# Altium project HDMI8x8.PrjPcb
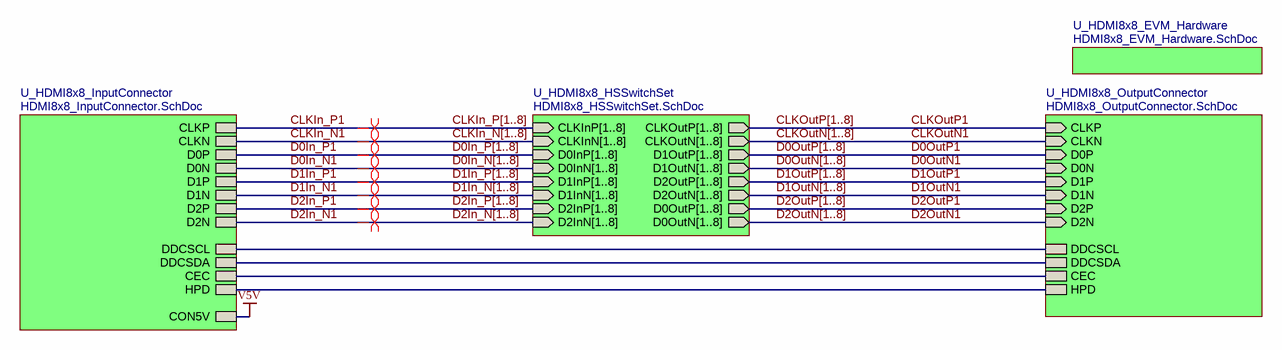
[diagram p0: HDMI8x8_CoverSheet.SchDoc]
TID: N/A; TechSupport: http://www.ti.com/support; SCH_Rev: E1; PRJ_Title: Change in menu Project|Project Options|Parameters; PRJ_Number: XX####; PRJ_Engineer: Enter name of project lead; PRJ_Customer: Public Release; PCB_Rev: E1; PCB_Layout: Who did the Layout?; CopyrightYear: 2016
5 sheets, 38 parts. Net scope: hierarchical (ports join the sheet entries above them; power ports are global).
Board file: HDMI8x8_EVM.PcbDoc
Sheets:
  HDMI8x8_CoverSheet.SchDoc
    U_HDMI8x8_InputConnector = HDMI8x8_InputConnector.SchDoc
    U_HDMI8x8_EVM_Hardware = HDMI8x8_EVM_Hardware.SchDoc
    U_HDMI8x8_HSSwitchSet = HDMI8x8_HSSwitchSet.SchDoc
    U_HDMI8x8_OutputConnector = HDMI8x8_OutputConnector.SchDoc

## Sheet HDMI8x8_CoverSheet.SchDoc
size A4; Date: Not shown in title block; ApprovedBy: Not shown in title block; CheckedBy: Not shown in title block; Author: Not shown in title block; CompanyName: Not shown in title block; Engineer: Not shown in title block; Organization: Not shown in title block; Address1: Not shown in title block; Address2: Not shown in title block; Address3: Not shown in title block; Address4: Not shown in title block; DocumentNumber: 1; Revision: Use project parameter SCH_Rev; SheetNumber: 1; SheetTotal: 3; PageSetup: Record=PageOptions|CenterHorizontal=True|CenterVertical=True|PrintScale=1.00|XCorrection=1.00|YCorrection=1.00|PrintKind=0|BorderSize=5000000|LeftOffset=0|BottomOffset=0|Orientation=2|PaperLength=1000|PaperWidth=1000|Scale=100|PaperSource=15|PrintQuality=600|MediaType=1|DitherType=10|PaperKind=Letter|PrintScaleMode=1; CurrentTime: Not shown in title block; CurrentDate: Not shown in title block; Time: Not shown in title block; DocumentFullPathAndName: Not shown in title block; DocumentName: Not shown in title block; ModifiedDate: Not shown in title block; ImagePath: Not shown in title block

### Sub-sheets
U_HDMI8x8_EVM_Hardware = HDMI8x8_EVM_Hardware.SchDoc: no entries
U_HDMI8x8_HSSwitchSet = HDMI8x8_HSSwitchSet.SchDoc: CLKInP[1..8] (in), CLKInN[1..8] (in), CLKOutP[1..8] (out), CLKOutN[1..8] (out), D1InP[1..8] (in), D1InN[1..8] (in), D1OutP[1..8] (out), D1OutN[1..8] (out), D2InP[1..8] (in), D2InN[1..8] (in), D2OutP[1..8] (out), D2OutN[1..8] (out), D0InP[1..8] (in), D0InN[1..8] (in), D0OutP[1..8] (out), D0OutN[1..8] (out)
U_HDMI8x8_InputConnector = HDMI8x8_InputConnector.SchDoc: D2P, D2N, D1P, D1N, D0P, D0N, CLKP, CLKN, CEC, DDCSCL, DDCSDA, CON5V, HPD
U_HDMI8x8_OutputConnector = HDMI8x8_OutputConnector.SchDoc: D2P (in), D2N (in), D1P (in), D1N (in), D0P (in), D0N (in), CLKP (in), CLKN (in), CEC, DDCSCL, DDCSDA, HPD

### Nets
CEC: sheet U_HDMI8x8_InputConnector/CEC, sheet U_HDMI8x8_OutputConnector/CEC
DDCSCL: sheet U_HDMI8x8_InputConnector/DDCSCL, sheet U_HDMI8x8_OutputConnector/DDCSCL
DDCSDA: sheet U_HDMI8x8_InputConnector/DDCSDA, sheet U_HDMI8x8_OutputConnector/DDCSDA
HPD: sheet U_HDMI8x8_InputConnector/HPD, sheet U_HDMI8x8_OutputConnector/HPD

### Buses and harness runs
bus CLKIn_N[1..8] = sheet U_HDMI8x8_HSSwitchSet/CLKInN[1..8]
bus CLKIn_P[1..8] = sheet U_HDMI8x8_HSSwitchSet/CLKInP[1..8]
bus CLKOutN[1..8] = sheet U_HDMI8x8_HSSwitchSet/CLKOutN[1..8]
bus CLKOutP[1..8] = sheet U_HDMI8x8_HSSwitchSet/CLKOutP[1..8]
bus D0In_N[1..8] = sheet U_HDMI8x8_HSSwitchSet/D0InN[1..8]
bus D0In_P[1..8] = sheet U_HDMI8x8_HSSwitchSet/D0InP[1..8]
bus D0OutN[1..8] = sheet U_HDMI8x8_HSSwitchSet/D1OutN[1..8]
bus D0OutP[1..8] = sheet U_HDMI8x8_HSSwitchSet/D1OutP[1..8]
bus D1In_N[1..8] = sheet U_HDMI8x8_HSSwitchSet/D1InN[1..8]
bus D1In_P[1..8] = sheet U_HDMI8x8_HSSwitchSet/D1InP[1..8]
bus D1OutN[1..8] = sheet U_HDMI8x8_HSSwitchSet/D2OutN[1..8]
bus D1OutP[1..8] = sheet U_HDMI8x8_HSSwitchSet/D2OutP[1..8]
bus D2In_N[1..8] = sheet U_HDMI8x8_HSSwitchSet/D2InN[1..8]
bus D2In_P[1..8] = sheet U_HDMI8x8_HSSwitchSet/D2InP[1..8]
bus D2OutN[1..8] = sheet U_HDMI8x8_HSSwitchSet/D0OutN[1..8]
bus D2OutP[1..8] = sheet U_HDMI8x8_HSSwitchSet/D0OutP[1..8]

### Layout directives
differential pair: CLKIn_N1, CLKIn_P1, D0In_N1, D0In_P1, D1In_N1, D1In_P1, D2In_N1, D2In_P1

### Notes on the sheet
- Drawn By:
- SVN Rev:
- Number:
- TID #:
- Orderable:
- Rev:
- Sheet Title:
- File:
- Project Title:
- Designed for:
- Assembly Variant:
- Mod. Date:
- Sheet:
- Size:
- of
- A4
- http://www.ti.com
- Texas Instruments and/or its licensors do not warrant the accuracy or completeness of this specification or any information contained therein. Texas Instruments and/or its licensors do not warrant that this design will meet the specifications, will be suitable for your application or fit for any particular purpose, or will operate in an implementation. Texas Instruments and/or its licensors do not warrant that the design is production worthy. You should completely validate and test your design implementation to confirm the system functionality for your application.
- Engineer:
- Contact:
- © Texas Instruments

## Sheet HDMI8x8_InputConnector.SchDoc
size Letter; Date: Not shown in title block; ApprovedBy: Not shown in title block; CheckedBy: Not shown in title block; Author: Not shown in title block; CompanyName: Not shown in title block; Engineer: Not shown in title block; Organization: Not shown in title block; Address1: Not shown in title block; Address2: Not shown in title block; Address3: Not shown in title block; Address4: Not shown in title block; DocumentNumber: 1; Revision: Use project parameter SCH_Rev; SheetNumber: 2; SheetTotal: 3; PageSetup: Record=PageOptions|CenterHorizontal=True|CenterVertical=True|PrintScale=1.00|XCorrection=1.00|YCorrection=1.00|PrintKind=0|BorderSize=5000000|LeftOffset=0|BottomOffset=0|Orientation=2|PaperLength=1000|PaperWidth=1000|Scale=100|PaperSource=15|PrintQuality=600|MediaType=1|DitherType=10|PaperKind=Letter|PrintScaleMode=1; CurrentTime: Not shown in title block; CurrentDate: Not shown in title block; Time: Not shown in title block; DocumentFullPathAndName: Not shown in title block; DocumentName: Not shown in title block; ModifiedDate: Not shown in title block; ImagePath: Not shown in title block
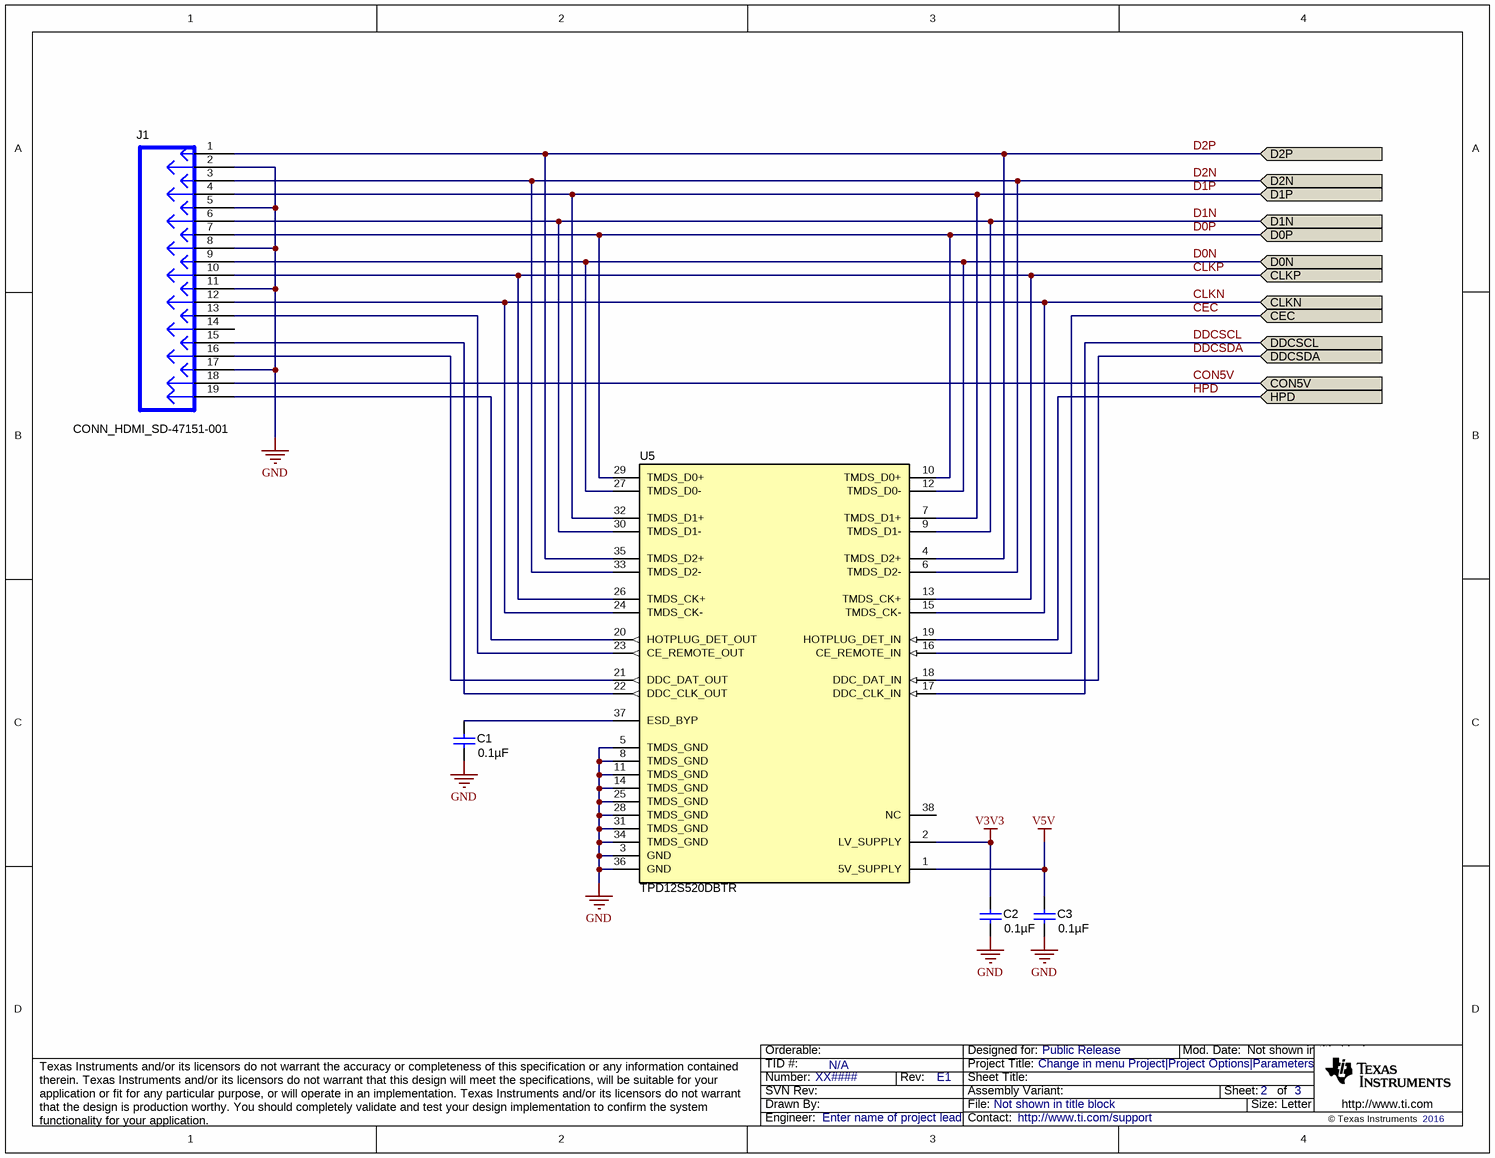
[diagram p1: HDMI8x8_InputConnector.SchDoc]

### Parts
C1  ValueDisplayed: 0.1µF  [0603]  (hidden comment: C0603C104M4RACTU)
C2  ValueDisplayed: 0.1µF  [0603]  (hidden comment: C0603C104M4RACTU)
C3  ValueDisplayed: 0.1µF  [0603]  (hidden comment: C0603C104M4RACTU)
J1  CONN_HDMI_SD-47151-001  [CONN_HDMI_SD-47151]
U5  TPD12S520DBTR  [DBT0038A_N]

### Ports
CEC, CLKN, CLKP, CON5V, D0N, D0P, D1N, D1P, D2N, D2P, DDCSCL, DDCSDA, HPD

### Nets
GND: C1.2 C2.2 C3.2 J1.2 J1.5 J1.8 J1.11 J1.17 U5.3(GND) U5.5(TMDS_GND) U5.8(TMDS_GND) U5.11(TMDS_GND) U5.14(TMDS_GND) U5.25(TMDS_GND) U5.28(TMDS_GND) U5.31(TMDS_GND) U5.34(TMDS_GND) U5.36(GND)
V3V3: C2.1 U5.2(LV_SUPPLY)
V5V: C3.1 J1.18 U5.1(5V_SUPPLY) ; port CON5V  [also labelled CON5V]
CEC: U5.16(CE_REMOTE_IN) ; port CEC
CLKN: J1.12 U5.15(TMDS_CK-) U5.24(TMDS_CK-) ; port CLKN  [project net CLKIn_N1]
CLKP: J1.10 U5.13(TMDS_CK+) U5.26(TMDS_CK+) ; port CLKP  [project net CLKIn_P1]
D0N: J1.9 U5.12(TMDS_D0-) U5.27(TMDS_D0-) ; port D0N  [project net D0In_N1]
D0P: J1.7 U5.10(TMDS_D0+) U5.29(TMDS_D0+) ; port D0P  [project net D0In_P1]
D1N: J1.6 U5.9(TMDS_D1-) U5.30(TMDS_D1-) ; port D1N  [project net D1In_N1]
D1P: J1.4 U5.7(TMDS_D1+) U5.32(TMDS_D1+) ; port D1P  [project net D1In_P1]
D2N: J1.3 U5.6(TMDS_D2-) U5.33(TMDS_D2-) ; port D2N  [project net D2In_N1]
D2P: J1.1 U5.4(TMDS_D2+) U5.35(TMDS_D2+) ; port D2P  [project net D2In_P1]
DDCSCL: U5.17(DDC_CLK_IN) ; port DDCSCL
DDCSDA: U5.18(DDC_DAT_IN) ; port DDCSDA
HPD: U5.19(HOTPLUG_DET_IN) ; port HPD
NetC1_1: C1.1 U5.37(ESD_BYP)
NetJ1_13: J1.13 U5.23(CE_REMOTE_OUT)
NetJ1_15: J1.15 U5.22(DDC_CLK_OUT)
NetJ1_16: J1.16 U5.21(DDC_DAT_OUT)
NetJ1_19: J1.19 U5.20(HOTPLUG_DET_OUT)

Not connected (* = marked no-connect by the designer): J1 14; U5 38(NC)

### Notes on the sheet
- Drawn By:
- SVN Rev:
- Number:
- TID #:
- Orderable:
- Rev:
- Sheet Title:
- File:
- Project Title:
- Designed for:
- Assembly Variant:
- Mod. Date:
- Sheet:
- Size:
- of
- Letter
- http://www.ti.com
- Texas Instruments and/or its licensors do not warrant the accuracy or completeness of this specification or any information contained therein. Texas Instruments and/or its licensors do not warrant that this design will meet the specifications, will be suitable for your application or fit for any particular purpose, or will operate in an implementation. Texas Instruments and/or its licensors do not warrant that the design is production worthy. You should completely validate and test your design implementation to confirm the system functionality for your application.
- Engineer:
- Contact:
- © Texas Instruments

### Library data of the parts
C1-C3 = C0603C104M4RACTU: CAP, CERM, 0.1 µF, 16 V, +/- 20%, X7R, 0603; Manufacturer: Kemet; Polarized: N; CompType: Capacitor; Value: 0.1uF; U/M: EA; Cap_F: 0.0000001; Tolerance_%: 20; Value1: Unknown; VDC_V: 16; Value2: 16V; TaMin_C: -55; TaMax_C: 125; AEC Category: Q200; SymbolVersion: 2008-07-09; PartNumber: C0603C104M4RACTU; PackageReference: 0603; RoHS: Y; MountType: SMT; Technology: Ceramic; TempCo: X7R; Cap_Case: 0603; Published: 2008-06-19; Publisher: Texas Instruments; LatestRevisionDate: 2016-01-22; ComponentLink1Description: Datasheet link; ComponentLink1URL: http://www.kemet.com/kemet/web/homepage/kechome.nsf/vapubfiles/F3102_Y5V.pdf/$file/F3102_Y5V.pdf; Supplier 1: Digi-Key; Supplier Part Number 1: 399-1099-1-ND; Supplier 2: Mouser; Supplier Part Number 2: 80-C0603C104M4R; Supplier 3: Farnell; Supplier Part Number 3: 1166968; AEC Qualified: ?
J1 = CONN_HDMI_SD-47151-001: Connector, HDMI, RA, 19 pin; Manufacturer: Molex; PartNumber: SD-47151-0001; area: 255.00 mm; Value: SD-47151-0001; ComponentHeight: 4.5 mm; SymbolVersion: 10/16/2009 11:19:45; ComponentLink1URL: \\vette02\pmp_pcb\pcad_pdf's\471510001_sd.pdf; PackageReference: 12.50 x 15.00 mm; ComponentLink1Description: AEO Datasheet Link
U5 = TPD12S520DBTR: HDMI Receiver Port Protection and Interface Device, 12 Channels, -40 to +85 degC, 38-pin TSSOP (DBT), Green (RoHS & no Sb/Br); Manufacturer: Texas Instruments; Alternate PartNumber: Equivalent; Breakdown Voltage(Min)(V): 9; Differential Capacitance(pF): 0.05; IEC 61000-4-2 Contact(+/- kV): 8; IO Capacitance(Typ)(pF): 0.9; SubFamily: ESD Solution; DatasheetVersion: SLVS640C; PackageVersion: revI, Mar-2011; PackageReference: DBT0038A; PackageDescription: 38-Pin Plastic Small Outline 0.5 mm Pitch; Supplier 1: Digi-Key; Supplier Part Number 1: 296-23617-2-ND; Supplier 2: Digi-Key; Supplier Part Number 2: 296-23617-1-ND; Supplier 3: Digi-Key; Supplier Part Number 3: 296-23617-6-ND; Supplier 4: Newark; Supplier Part Number 4: 85M0176; Supplier 5: Mouser; Supplier Part Number 5: 595-TPD12S520DBTR; Eco-Plan: Green (RoHS & no Sb/Br); IO Leakage Current(nA): 0.05; MountType: SMT; Code_JEDEC: MO-153; PartNumber: TPD12S520DBTR; ComponentLink1Description: Datasheet; ComponentLink1URL: http://www.ti.com/general/docs/lit/getliterature.tsp?genericPartNumber=TPD12S520&fileType=pdf; ComponentLink2Description: URL Link1; ComponentLink2URL: SamplesURL:http://www.ti.com/product/tpd12s520#samples; Alternate Manufacturer: Texas Instruments

## Sheet HDMI8x8_EVM_Hardware.SchDoc
size 431 x 279 mm; Date: Not shown in title block; ApprovedBy: Not shown in title block; CheckedBy: Not shown in title block; Author: Not shown in title block; CompanyName: Not shown in title block; Engineer: Not shown in title block; Organization: Not shown in title block; Address1: Not shown in title block; Address2: Not shown in title block; Address3: Not shown in title block; Address4: Not shown in title block; DocumentNumber: 1; Revision: Use project parameter SCH_Rev; SheetNumber: 3; SheetTotal: 3; PageSetup: Record=PageOptions|CenterHorizontal=True|CenterVertical=True|PrintScale=1.00|XCorrection=1.00|YCorrection=1.00|PrintKind=0|BorderSize=5000000|LeftOffset=0|BottomOffset=0|Orientation=2|PaperLength=1000|PaperWidth=1000|Scale=100|PaperSource=15|PrintQuality=600|MediaType=1|DitherType=10|PaperKind=Letter|PrintScaleMode=1; CurrentTime: Not shown in title block; CurrentDate: Not shown in title block; Time: Not shown in title block; DocumentFullPathAndName: Not shown in title block; DocumentName: Not shown in title block; ModifiedDate: Not shown in title block; ImagePath: Not shown in title block
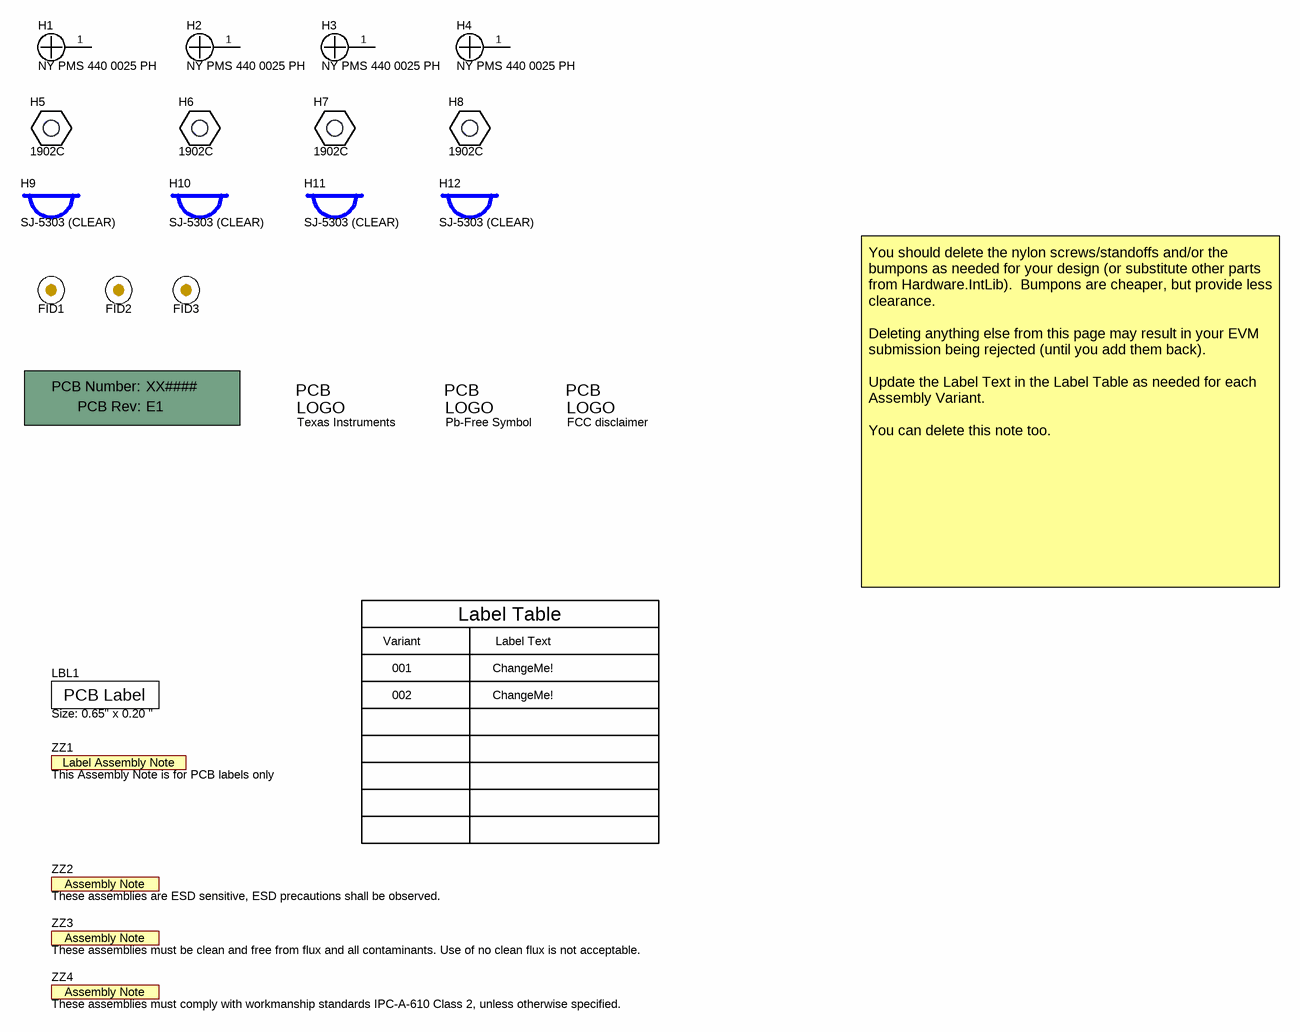
[diagram p2: HDMI8x8_EVM_Hardware.SchDoc]

### Parts
!PCB  Printed Circuit Board  (value not drawn)  (mechanical)
FID1  Fiducial  [Fiducial10-20]  (value not drawn)
FID2  Fiducial  [Fiducial10-20]  (value not drawn)
FID3  Fiducial  [Fiducial10-20]  (value not drawn)
H1  NY PMS 440 0025 PH  [NY PMS 440 0025 PH]
H2  NY PMS 440 0025 PH  [NY PMS 440 0025 PH]
H3  NY PMS 440 0025 PH  [NY PMS 440 0025 PH]
H4  NY PMS 440 0025 PH  [NY PMS 440 0025 PH]
H5  1902C  [Keystone_1902C]
H6  1902C  [Keystone_1902C]
H7  1902C  [Keystone_1902C]
H8  1902C  [Keystone_1902C]
H9  SJ-5303 (CLEAR)  [Bumpon_SJ5003Transparent]
H10  SJ-5303 (CLEAR)  [Bumpon_SJ5003Transparent]
H11  SJ-5303 (CLEAR)  [Bumpon_SJ5003Transparent]
H12  SJ-5303 (CLEAR)  [Bumpon_SJ5003Transparent]
LBL1  Size: 0.65" x 0.20 "  [Label_650x200]
Logo1  Texas Instruments  [TI_Stacked_Overlay_Small]  (no BOM)
Logo2  Pb-Free Symbol  [Pb-Free_Overlay_Small]  (no BOM)
Logo3  FCC disclaimer  [FCC_disclaimer]  (no BOM)
ZZ1  This Assembly Note is for PCB labels only  [AssemblyNoteLabel]  (no BOM)
ZZ2  These assemblies are ESD sensitive, ESD precautions shall be observed.  [AssemblyNote]  (no BOM)
ZZ3  These assemblies must be clean and free from flux and all contaminants. Use of no clean flux is not acceptable.  [AssemblyNote]  (no BOM)
ZZ4  These assemblies must comply with workmanship standards IPC-A-610 Class 2, unless otherwise specified.  [AssemblyNote]  (no BOM)

### Nets

Not connected (* = marked no-connect by the designer): H1 1; H2 1; H3 1; H4 1

### Notes on the sheet
- Variant
- Label Table
- Label Text
- You should delete the nylon screws/standoffs and/or the bumpons as needed for your design (or substitute other parts from Hardware.IntLib).  Bumpons are cheaper, but provide less clearance.
  Deleting anything else from this page may result in your EVM submission being rejected (until you add them back).
  Update the Label Text in the Label Table as needed for each Assembly Variant.
  You can delete this note too.
- 001
- 002
- ChangeMe!
- Drawn By:
- SVN Rev:
- Number:
- TID #:
- Orderable:
- Rev:
- Sheet Title:
- File:
- Project Title:
- Designed for:
- Assembly Variant:
- Mod. Date:
- Sheet:
- Size:
- of
- B
- http://www.ti.com
- Texas Instruments and/or its licensors do not warrant the accuracy or completeness of this specification or any information contained therein. Texas Instruments and/or its licensors do not warrant that this design will meet the specifications, will be suitable for your application or fit for any particular purpose, or will operate in an implementation. Texas Instruments and/or its licensors do not warrant that the design is production worthy. You should completely validate and test your design implementation to confirm the system functionality for your application.
- Engineer:
- Contact:
- © Texas Instruments
- (in symbol AssemblyNote) Assembly Note
- (in symbol AssemblyNoteLabel) Label Assembly Note
- (in symbol FCC_disclaimer) PCB; LOGO
- (in symbol Pb-Free) PCB; LOGO
- (in symbol PCB) PCB Number:; PCB Rev:
- (in symbol THT-14-423-10) PCB Label
- (in symbol TI_Logo) PCB; LOGO

### Library data of the parts
!PCB = PCB: Manufacturer: Any; PartNumber: XX####; SymbolCreator: a0412235; SymbolVersion: 2012-05-30; CompType: PCB; RoHS: O; MountType: N/A; Publisher: Texas Instruments; LatestRevisionDate: 2012-06-27; LatestRevisionNote: Initial Version; Alternate Manufacturer: -; Alternate PartNumber: -
FID1-FID3 = Fiducial: Fiducial mark.  There is nothing to buy or mount.; SymbolCreator: codlsc; SymbolVersion: 2009-11-4; CompType: Fiducial; Publisher: Texas Instruments; LatestRevisionDate: 2014-08-01; LatestRevisionNote: Added Alternate PartNumber and Alternate Manufacturer parameters to appropriate components.; Manufacturer: N/A; MountType: N/A; PackageReference: Fiducial; PartNumber: N/A; ClassName: FiducialMark
H1-H4 = NY PMS 440 0025 PH: Machine Screw, Round, #4-40 x 1/4, Nylon, Philips panhead; Manufacturer: B&F Fastener Supply; CompType: Hardware; SymbolCreator: codlsc; U/M: EA; SymbolVersion: 2009-10-28; MountType: N/A; RoHS: Y; PartNumber: NY PMS 440 0025 PH; PackageReference: Screw; DigiKeyPartNumber: H542-ND; ComponentLink1Description: Datasheet Link; ComponentLink1URL: http://www.fasnetdirect.com/refguide/Nylpanms.pdf; ClassName: Mounting Holes; LatestRevisionDate: 2015-07-23; Publisher: Texas Instruments; Supplier 1: Digi-Key; Supplier Part Number 1: H542-ND
H5-H8 = 1902C: Standoff, Hex, 0.5"L #4-40 Nylon; Manufacturer: Keystone; CompType: Hardware; MountType: N/A; RoHS: Y; PartNumber: 1902C; PackageReference: Standoff; ComponentLink1Description: Datasheet Link; ComponentLink1URL: http://www.keyelco.com/pdfs/M55-prod31.pdf; Alternate Manufacturer: -; Alternate PartNumber: -; LatestRevisionDate: 2012-06-27; LatestRevisionNote: Initial Version; Publisher: Texas Instruments; Supplier 1: Digi-Key; Supplier Part Number 1: 1902CK-ND
H9-H12 = SJ-5303 (CLEAR): Bumpon, Hemisphere, 0.44 X 0.20, Clear; Manufacturer: 3M; SymbolCreator: a0412235; SymbolVersion: 2012-03-04; CompType: Bumpon; PartNumber: SJ-5303 (CLEAR); RoHS: Y; PackageReference: Transparent Bumpon; MountType: N/A; ComponentLink1Description: Datasheet Link; ComponentLink1URL: http://multimedia.mmm.com/mws/mediawebserver.dyn?6666660Zjcf6lVs6EVs666cIsCOrrrrQ-; Publisher: Texas Instruments; LatestRevisionDate: 2013-10-02; Supplier 1: Digi-Key; Supplier Part Number 1: SJ5303-7-ND; Supplier 2: Mouser; Supplier Part Number 2: 517-SJ-5303CL; Supplier 3: Newark; Supplier Part Number 3: 23M7326
LBL1 = THT-14-423-10: Thermal Transfer Printable Labels, 0.650" W x 0.200" H - 10,000 per roll; Manufacturer: Brady; SymbolCreator: a0412235; CompType: Label; SymbolVersion: 2012-06-12; ClassName: Label; PartNumber: THT-14-423-10; RoHS: Y; PackageReference: PCB Label 0.650"H x 0.200"W; MountType: N/A; ComponentLink1Description: Web Page; ComponentLink1URL: http://www.bradyid.com/bradyid/pdpv/THT-14-423-10.html; Note: Size: 0.65" x 0.20 "; Publisher: Texas Instruments; LatestRevisionDate: 2012-07-31; LatestRevisionNote: Initial Version; Alternate Manufacturer: -; Alternate PartNumber: -; Supplier 1: Farnell; Supplier Part Number 1: 2065596; Supplier 2: Newark; Supplier Part Number 2: 97C5133
Logo1 = TI_Logo: Texas Instrument Corporate Signature; SymbolCreator: codlsc; SymbolVersion: 2011-08-22; Published: 2009-03-03; Publisher: National Semiconductor; ClassName: Logo; LatestRevisionDate: 2011-10-25; LatestRevisionNote: Added ClassName of Logo.
Logo2 = Pb-Free: SymbolCreator: a0412235; SymbolVersion: 2011-08-22; Published: 2009-03-03; Publisher: Texas Instruments; LatestRevisionDate: 2014-08-05
Logo3 = FCC_disclaimer: SymbolCreator: codlsc; SymbolVersion: 2011-08-22; Published: 2009-03-03; Publisher: Texas Instruments; LatestRevisionDate: 2014-11-20
ZZ1 = AssemblyNoteLabel: SymbolCreator: a0412235; SymbolVersion: 2012-06-14; CompType: AssemblyNote; ClassName: AssemblyNote; Publisher: Texas Instruments; LatestRevisionDate: 2012-07-31; LatestRevisionNote: Initial Version; Alternate Manufacturer: -; Alternate PartNumber: -
ZZ2-ZZ4 = AssemblyNote: SymbolCreator: codlsc; SymbolVersion: 2010-05-18; CompType: AssemblyNote; ClassName: AssemblyNote; Publisher: Texas Instruments; LatestRevisionDate: 2012-06-14; LatestRevisionNote: Initial Version; Alternate Manufacturer: -; Alternate PartNumber: -

## Sheet HDMI8x8_HSSwitchSet.SchDoc
size 431 x 279 mm; Date: Not shown in title block; ApprovedBy: Not shown in title block; CheckedBy: Not shown in title block; Author: Not shown in title block; CompanyName: Not shown in title block; Engineer: Not shown in title block; Organization: Not shown in title block; Address1: Not shown in title block; Address2: Not shown in title block; Address3: Not shown in title block; Address4: Not shown in title block; DocumentNumber: 1; Revision: Use project parameter SCH_Rev; SheetNumber: 2; SheetTotal: 3; PageSetup: Record=PageOptions|CenterHorizontal=True|CenterVertical=True|PrintScale=1.00|XCorrection=1.00|YCorrection=1.00|PrintKind=0|BorderSize=5000000|LeftOffset=0|BottomOffset=0|Orientation=2|PaperLength=1000|PaperWidth=1000|Scale=100|PaperSource=15|PrintQuality=600|MediaType=1|DitherType=10|PaperKind=Letter|PrintScaleMode=1; CurrentTime: Not shown in title block; CurrentDate: Not shown in title block; Time: Not shown in title block; DocumentFullPathAndName: Not shown in title block; DocumentName: Not shown in title block; ModifiedDate: Not shown in title block; ImagePath: Not shown in title block
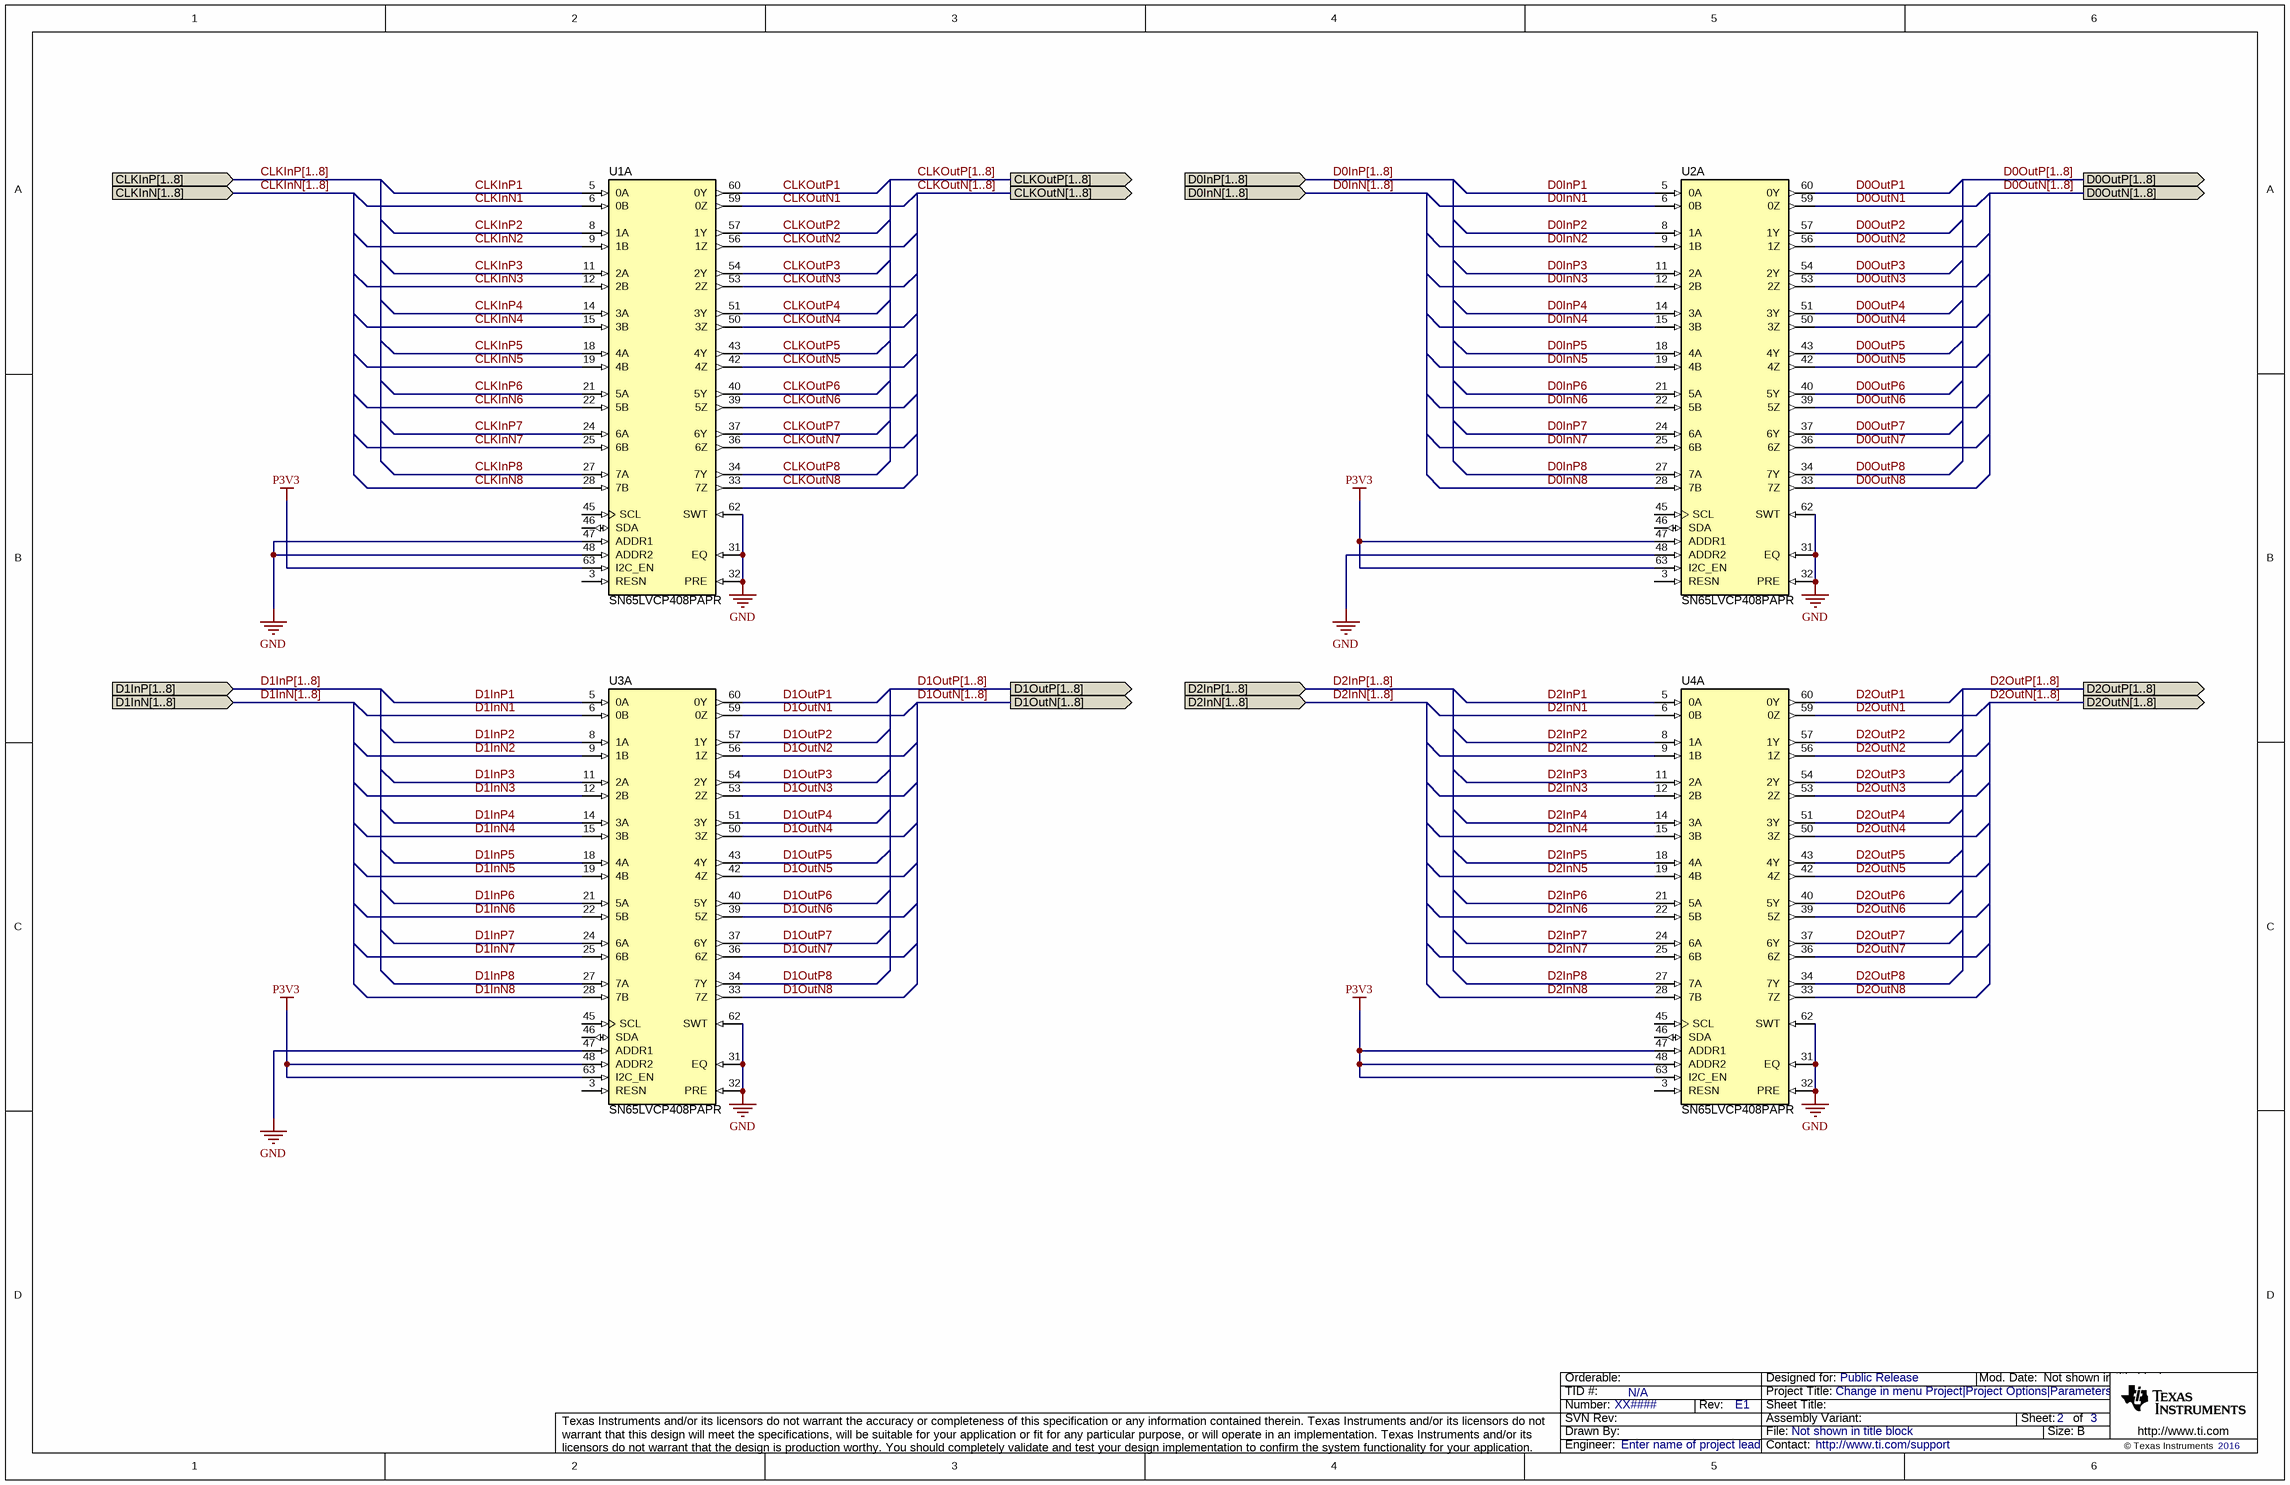
[diagram p3: HDMI8x8_HSSwitchSet.SchDoc]

### Parts
U1  SN65LVCP408PAPR  [PAP0064D_N]  (part A of 2)
U2  SN65LVCP408PAPR  [PAP0064D_N]  (part A of 2)
U3  SN65LVCP408PAPR  [PAP0064D_N]  (part A of 2)
U4  SN65LVCP408PAPR  [PAP0064D_N]  (part A of 2)

### Ports
CLKInN[1..8] (in), CLKInP[1..8] (in), CLKOutN[1..8] (out), CLKOutP[1..8] (out), D0InN[1..8] (in), D0InP[1..8] (in), D0OutN[1..8] (out), D0OutP[1..8] (out), D1InN[1..8] (in), D1InP[1..8] (in), D1OutN[1..8] (out), D1OutP[1..8] (out), D2InN[1..8] (in), D2InP[1..8] (in), D2OutN[1..8] (out), D2OutP[1..8] (out)

### Nets
GND: U1.31(EQ) U1.32(PRE) U1.47(ADDR1) U1.48(ADDR2) U1.62(SWT) U2.31(EQ) U2.32(PRE) U2.48(ADDR2) U2.62(SWT) U3.31(EQ) U3.32(PRE) U3.47(ADDR1) U3.62(SWT) U4.31(EQ) U4.32(PRE) U4.62(SWT)
P3V3: U1.63(I2C_EN) U2.47(ADDR1) U2.63(I2C_EN) U3.48(ADDR2) U3.63(I2C_EN) U4.47(ADDR1) U4.48(ADDR2) U4.63(I2C_EN)
CLKInN1: U1.6(0B)  [project net CLKIn_N1]
CLKInN2: U1.9(1B)  [project net CLKIn_N2]
CLKInN3: U1.12(2B)  [project net CLKIn_N3]
CLKInN4: U1.15(3B)  [project net CLKIn_N4]
CLKInN5: U1.19(4B)  [project net CLKIn_N5]
CLKInN6: U1.22(5B)  [project net CLKIn_N6]
CLKInN7: U1.25(6B)  [project net CLKIn_N7]
CLKInN8: U1.28(7B)  [project net CLKIn_N8]
CLKInP1: U1.5(0A)  [project net CLKIn_P1]
CLKInP2: U1.8(1A)  [project net CLKIn_P2]
CLKInP3: U1.11(2A)  [project net CLKIn_P3]
CLKInP4: U1.14(3A)  [project net CLKIn_P4]
CLKInP5: U1.18(4A)  [project net CLKIn_P5]
CLKInP6: U1.21(5A)  [project net CLKIn_P6]
CLKInP7: U1.24(6A)  [project net CLKIn_P7]
CLKInP8: U1.27(7A)  [project net CLKIn_P8]
CLKOutN1: U1.59(0Z)
CLKOutN2: U1.56(1Z)
CLKOutN3: U1.53(2Z)
CLKOutN4: U1.50(3Z)
CLKOutN5: U1.42(4Z)
CLKOutN6: U1.39(5Z)
CLKOutN7: U1.36(6Z)
CLKOutN8: U1.33(7Z)
CLKOutP1: U1.60(0Y)
CLKOutP2: U1.57(1Y)
CLKOutP3: U1.54(2Y)
CLKOutP4: U1.51(3Y)
CLKOutP5: U1.43(4Y)
CLKOutP6: U1.40(5Y)
CLKOutP7: U1.37(6Y)
CLKOutP8: U1.34(7Y)
D0InN1: U2.6(0B)  [project net D0In_N1]
D0InN2: U2.9(1B)  [project net D0In_N2]
D0InN3: U2.12(2B)  [project net D0In_N3]
D0InN4: U2.15(3B)  [project net D0In_N4]
D0InN5: U2.19(4B)  [project net D0In_N5]
D0InN6: U2.22(5B)  [project net D0In_N6]
D0InN7: U2.25(6B)  [project net D0In_N7]
D0InN8: U2.28(7B)  [project net D0In_N8]
D0InP1: U2.5(0A)  [project net D0In_P1]
D0InP2: U2.8(1A)  [project net D0In_P2]
D0InP3: U2.11(2A)  [project net D0In_P3]
D0InP4: U2.14(3A)  [project net D0In_P4]
D0InP5: U2.18(4A)  [project net D0In_P5]
D0InP6: U2.21(5A)  [project net D0In_P6]
D0InP7: U2.24(6A)  [project net D0In_P7]
D0InP8: U2.27(7A)  [project net D0In_P8]
D0OutN1: U2.59(0Z)  [project net D2OutN1]
D0OutN2: U2.56(1Z)  [project net D2OutN2]
D0OutN3: U2.53(2Z)  [project net D2OutN3]
D0OutN4: U2.50(3Z)  [project net D2OutN4]
D0OutN5: U2.42(4Z)  [project net D2OutN5]
D0OutN6: U2.39(5Z)  [project net D2OutN6]
D0OutN7: U2.36(6Z)  [project net D2OutN7]
D0OutN8: U2.33(7Z)  [project net D2OutN8]
D0OutP1: U2.60(0Y)  [project net D2OutP1]
D0OutP2: U2.57(1Y)  [project net D2OutP2]
D0OutP3: U2.54(2Y)  [project net D2OutP3]
D0OutP4: U2.51(3Y)  [project net D2OutP4]
D0OutP5: U2.43(4Y)  [project net D2OutP5]
D0OutP6: U2.40(5Y)  [project net D2OutP6]
D0OutP7: U2.37(6Y)  [project net D2OutP7]
D0OutP8: U2.34(7Y)  [project net D2OutP8]
D1InN1: U3.6(0B)  [project net D1In_N1]
D1InN2: U3.9(1B)  [project net D1In_N2]
D1InN3: U3.12(2B)  [project net D1In_N3]
D1InN4: U3.15(3B)  [project net D1In_N4]
D1InN5: U3.19(4B)  [project net D1In_N5]
D1InN6: U3.22(5B)  [project net D1In_N6]
D1InN7: U3.25(6B)  [project net D1In_N7]
D1InN8: U3.28(7B)  [project net D1In_N8]
D1InP1: U3.5(0A)  [project net D1In_P1]
D1InP2: U3.8(1A)  [project net D1In_P2]
D1InP3: U3.11(2A)  [project net D1In_P3]
D1InP4: U3.14(3A)  [project net D1In_P4]
D1InP5: U3.18(4A)  [project net D1In_P5]
D1InP6: U3.21(5A)  [project net D1In_P6]
D1InP7: U3.24(6A)  [project net D1In_P7]
D1InP8: U3.27(7A)  [project net D1In_P8]
D1OutN1: U3.59(0Z)  [project net D0OutN1]
D1OutN2: U3.56(1Z)  [project net D0OutN2]
D1OutN3: U3.53(2Z)  [project net D0OutN3]
D1OutN4: U3.50(3Z)  [project net D0OutN4]
D1OutN5: U3.42(4Z)  [project net D0OutN5]
D1OutN6: U3.39(5Z)  [project net D0OutN6]
D1OutN7: U3.36(6Z)  [project net D0OutN7]
D1OutN8: U3.33(7Z)  [project net D0OutN8]
D1OutP1: U3.60(0Y)  [project net D0OutP1]
D1OutP2: U3.57(1Y)  [project net D0OutP2]
D1OutP3: U3.54(2Y)  [project net D0OutP3]
D1OutP4: U3.51(3Y)  [project net D0OutP4]
D1OutP5: U3.43(4Y)  [project net D0OutP5]
D1OutP6: U3.40(5Y)  [project net D0OutP6]
D1OutP7: U3.37(6Y)  [project net D0OutP7]
D1OutP8: U3.34(7Y)  [project net D0OutP8]
D2InN1: U4.6(0B)  [project net D2In_N1]
D2InN2: U4.9(1B)  [project net D2In_N2]
D2InN3: U4.12(2B)  [project net D2In_N3]
D2InN4: U4.15(3B)  [project net D2In_N4]
D2InN5: U4.19(4B)  [project net D2In_N5]
D2InN6: U4.22(5B)  [project net D2In_N6]
D2InN7: U4.25(6B)  [project net D2In_N7]
D2InN8: U4.28(7B)  [project net D2In_N8]
D2InP1: U4.5(0A)  [project net D2In_P1]
D2InP2: U4.8(1A)  [project net D2In_P2]
D2InP3: U4.11(2A)  [project net D2In_P3]
D2InP4: U4.14(3A)  [project net D2In_P4]
D2InP5: U4.18(4A)  [project net D2In_P5]
D2InP6: U4.21(5A)  [project net D2In_P6]
D2InP7: U4.24(6A)  [project net D2In_P7]
D2InP8: U4.27(7A)  [project net D2In_P8]
D2OutN1: U4.59(0Z)  [project net D1OutN1]
D2OutN2: U4.56(1Z)  [project net D1OutN2]
D2OutN3: U4.53(2Z)  [project net D1OutN3]
D2OutN4: U4.50(3Z)  [project net D1OutN4]
D2OutN5: U4.42(4Z)  [project net D1OutN5]
D2OutN6: U4.39(5Z)  [project net D1OutN6]
D2OutN7: U4.36(6Z)  [project net D1OutN7]
D2OutN8: U4.33(7Z)  [project net D1OutN8]
D2OutP1: U4.60(0Y)  [project net D1OutP1]
D2OutP2: U4.57(1Y)  [project net D1OutP2]
D2OutP3: U4.54(2Y)  [project net D1OutP3]
D2OutP4: U4.51(3Y)  [project net D1OutP4]
D2OutP5: U4.43(4Y)  [project net D1OutP5]
D2OutP6: U4.40(5Y)  [project net D1OutP6]
D2OutP7: U4.37(6Y)  [project net D1OutP7]
D2OutP8: U4.34(7Y)  [project net D1OutP8]

Not connected (* = marked no-connect by the designer): U1 3(RESN) 45(SCL) 46(SDA); U2 3(RESN) 45(SCL) 46(SDA); U3 3(RESN) 45(SCL) 46(SDA); U4 3(RESN) 45(SCL) 46(SDA)

### Buses and harness runs
bus CLKInN[1..8] = port CLKInN[1..8]
bus CLKInP[1..8] = port CLKInP[1..8]
bus CLKOutN[1..8] = port CLKOutN[1..8]
bus CLKOutP[1..8] = port CLKOutP[1..8]
bus D0InN[1..8] = port D0InN[1..8]
bus D0InP[1..8] = port D0InP[1..8]
bus D0OutN[1..8] = port D0OutN[1..8]
bus D0OutP[1..8] = port D0OutP[1..8]
bus D1InN[1..8] = port D1InN[1..8]
bus D1InP[1..8] = port D1InP[1..8]
bus D1OutN[1..8] = port D1OutN[1..8]
bus D1OutP[1..8] = port D1OutP[1..8]
bus D2InN[1..8] = port D2InN[1..8]
bus D2InP[1..8] = port D2InP[1..8]
bus D2OutN[1..8] = port D2OutN[1..8]
bus D2OutP[1..8] = port D2OutP[1..8]

### Notes on the sheet
- Drawn By:
- SVN Rev:
- Number:
- TID #:
- Orderable:
- Rev:
- Sheet Title:
- File:
- Project Title:
- Designed for:
- Assembly Variant:
- Mod. Date:
- Sheet:
- Size:
- of
- B
- http://www.ti.com
- Texas Instruments and/or its licensors do not warrant the accuracy or completeness of this specification or any information contained therein. Texas Instruments and/or its licensors do not warrant that this design will meet the specifications, will be suitable for your application or fit for any particular purpose, or will operate in an implementation. Texas Instruments and/or its licensors do not warrant that the design is production worthy. You should completely validate and test your design implementation to confirm the system functionality for your application.
- Engineer:
- Contact:
- © Texas Instruments

### Library data of the parts
U1-U4 = SN65LVCP408PAPR: 8 x 8 4.25Gbps Crosspoint Swtich, 8 TX / 8 RX, 3.3V, -40 to 85 degC, 64-Pin HTQFP (PAP), Green (RoHS & no Sb/Br); Manufacturer: Texas Instruments; Alternate PartNumber: Equivalent; ICC(Max)(mA): 440; IN SigCon: EQ; OUT SigCon: Pre-E; ESD HBM(kV): 3; DatasheetVersion: SLLS842A; PackageVersion: revC, Aug-2003; PackageReference: PAP0064D; PackageDescription: 64-Pin Plastic Quad Flat Pack, 10 x 10 mm Body, 0.5 mm Pitch, Exposed Pad; Supplier 1: Digi-Key; Supplier Part Number 1: 296-25173-2-ND; Supplier 2: Digi-Key; Supplier Part Number 2: 296-25173-1-ND; Supplier 3: Digi-Key; Supplier Part Number 3: 296-25173-6-ND; Supplier 4: Newark; Supplier Part Number 4: 24R9948; Supplier 5: Mouser; Supplier Part Number 5: 595-SN65LVCP408PAPR; PartNumber: SN65LVCP408PAPR; MountType: SMT; Eco-Plan: Green (RoHS & no Sb/Br); Function: Crosspoint; Code_JEDEC: MS-026; ComponentLink1Description: Datasheet; ComponentLink1URL: http://www.ti.com/general/docs/lit/getliterature.tsp?genericPartNumber=SN65LVCP408&fileType=pdf; Alternate Manufacturer: Texas Instruments

## Sheet HDMI8x8_OutputConnector.SchDoc
size Letter; Date: Not shown in title block; ApprovedBy: Not shown in title block; CheckedBy: Not shown in title block; Author: Not shown in title block; CompanyName: Not shown in title block; Engineer: Not shown in title block; Organization: Not shown in title block; Address1: Not shown in title block; Address2: Not shown in title block; Address3: Not shown in title block; Address4: Not shown in title block; DocumentNumber: 1; Revision: Use project parameter SCH_Rev; SheetNumber: 2; SheetTotal: 3; PageSetup: Record=PageOptions|CenterHorizontal=True|CenterVertical=True|PrintScale=1.00|XCorrection=1.00|YCorrection=1.00|PrintKind=0|BorderSize=5000000|LeftOffset=0|BottomOffset=0|Orientation=2|PaperLength=1000|PaperWidth=1000|Scale=100|PaperSource=15|PrintQuality=600|MediaType=1|DitherType=10|PaperKind=Letter|PrintScaleMode=1; CurrentTime: Not shown in title block; CurrentDate: Not shown in title block; Time: Not shown in title block; DocumentFullPathAndName: Not shown in title block; DocumentName: Not shown in title block; ModifiedDate: Not shown in title block; ImagePath: Not shown in title block
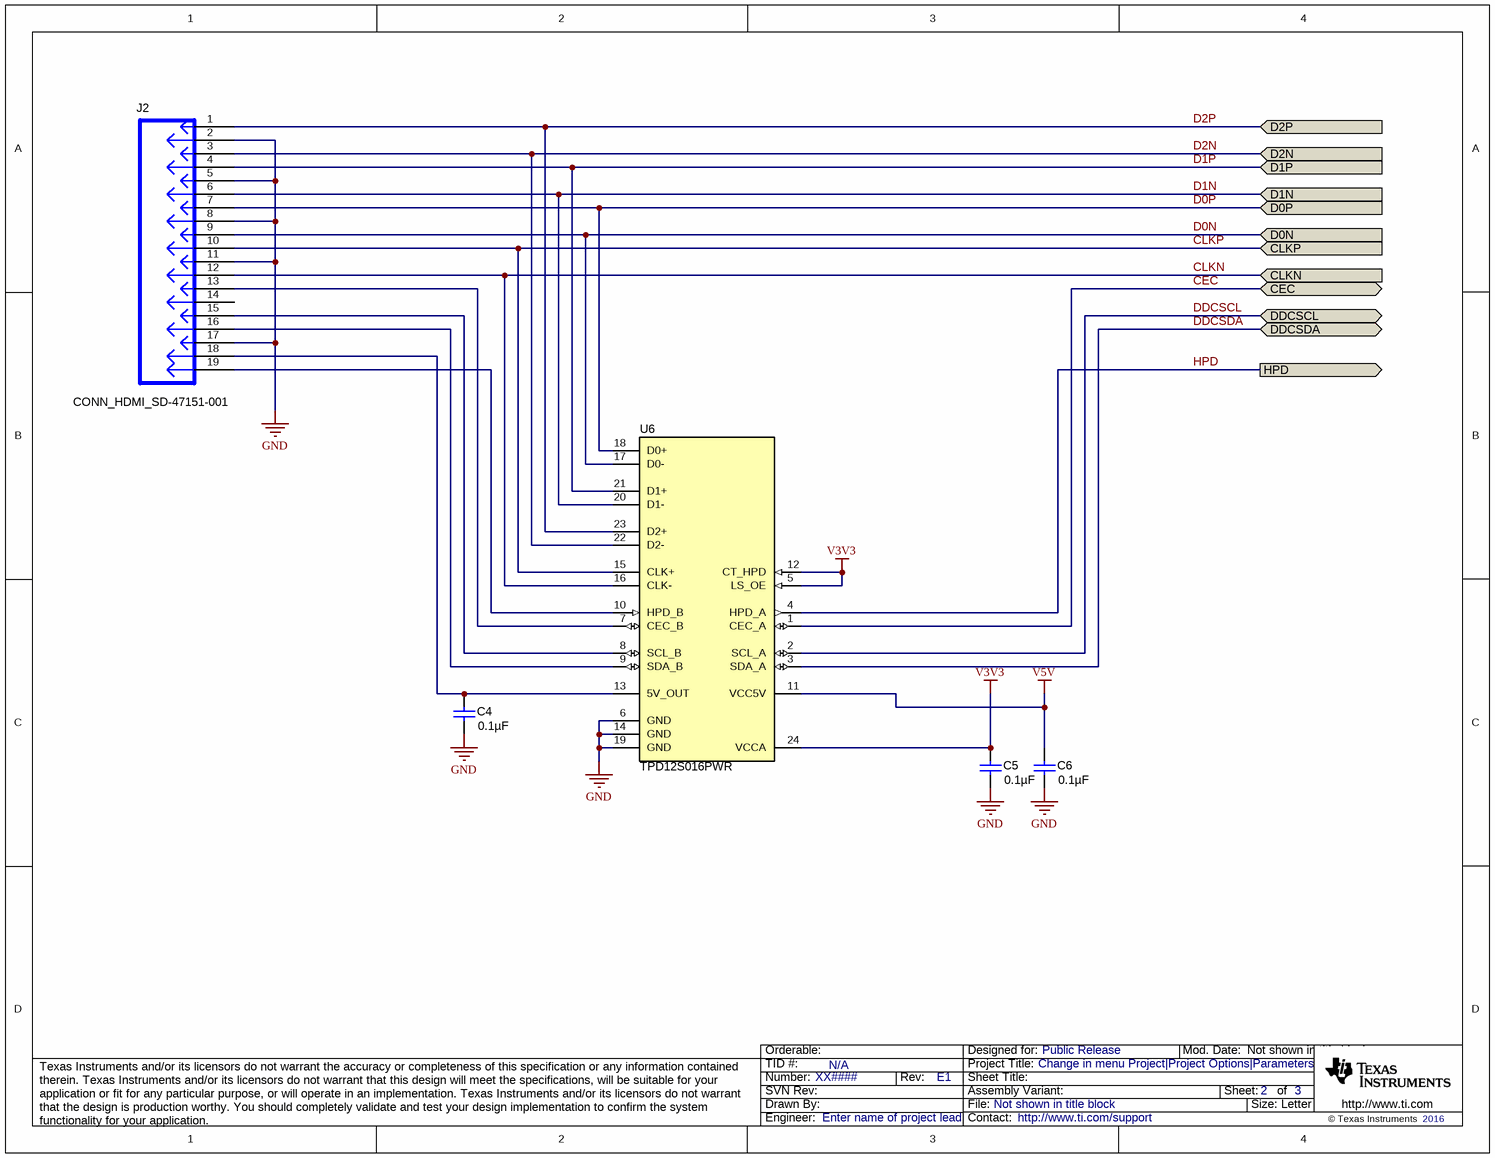
[diagram p4: HDMI8x8_OutputConnector.SchDoc]

### Parts
C4  ValueDisplayed: 0.1µF  [0603]  (hidden comment: C0603C104M4RACTU)
C5  ValueDisplayed: 0.1µF  [0603]  (hidden comment: C0603C104M4RACTU)
C6  ValueDisplayed: 0.1µF  [0603]  (hidden comment: C0603C104M4RACTU)
J2  CONN_HDMI_SD-47151-001  [CONN_HDMI_SD-47151]
U6  TPD12S016PWR  [PW0024A_N]

### Ports
CEC (bidir), CLKN (in), CLKP (in), D0N (in), D0P (in), D1N (in), D1P (in), D2N (in), D2P (in), DDCSCL (bidir), DDCSDA (bidir), HPD (out)

### Nets
GND: C4.2 C5.2 C6.2 J2.2 J2.5 J2.8 J2.11 J2.17 U6.6(GND) U6.14(GND) U6.19(GND)
V3V3: C5.1 U6.5(LS_OE) U6.12(CT_HPD) U6.24(VCCA)
V5V: C6.1 U6.11(VCC5V)
CEC: U6.1(CEC_A) ; port CEC
CLKN: J2.12 U6.16(CLK-) ; port CLKN  [project net CLKOutN1]
CLKP: J2.10 U6.15(CLK+) ; port CLKP  [project net CLKOutP1]
D0N: J2.9 U6.17(D0-) ; port D0N  [project net D0OutN1]
D0P: J2.7 U6.18(D0+) ; port D0P  [project net D0OutP1]
D1N: J2.6 U6.20(D1-) ; port D1N  [project net D1OutN1]
D1P: J2.4 U6.21(D1+) ; port D1P  [project net D1OutP1]
D2N: J2.3 U6.22(D2-) ; port D2N  [project net D2OutN1]
D2P: J2.1 U6.23(D2+) ; port D2P  [project net D2OutP1]
DDCSCL: U6.2(SCL_A) ; port DDCSCL
DDCSDA: U6.3(SDA_A) ; port DDCSDA
HPD: U6.4(HPD_A) ; port HPD
NetC4_1: C4.1 J2.18 U6.13(5V_OUT)
NetJ2_13: J2.13 U6.7(CEC_B)
NetJ2_15: J2.15 U6.8(SCL_B)
NetJ2_16: J2.16 U6.9(SDA_B)
NetJ2_19: J2.19 U6.10(HPD_B)

Not connected (* = marked no-connect by the designer): J2 14

### Notes on the sheet
- Drawn By:
- SVN Rev:
- Number:
- TID #:
- Orderable:
- Rev:
- Sheet Title:
- File:
- Project Title:
- Designed for:
- Assembly Variant:
- Mod. Date:
- Sheet:
- Size:
- of
- Letter
- http://www.ti.com
- Texas Instruments and/or its licensors do not warrant the accuracy or completeness of this specification or any information contained therein. Texas Instruments and/or its licensors do not warrant that this design will meet the specifications, will be suitable for your application or fit for any particular purpose, or will operate in an implementation. Texas Instruments and/or its licensors do not warrant that the design is production worthy. You should completely validate and test your design implementation to confirm the system functionality for your application.
- Engineer:
- Contact:
- © Texas Instruments

### Library data of the parts
C4-C6 = C0603C104M4RACTU: as C1 on sheet HDMI8x8_InputConnector; SymbolVersion: 2008-07-09; PartNumber: C0603C104M4RACTU; PackageReference: 0603; RoHS: Y; MountType: SMT; Technology: Ceramic; TempCo: X7R; Cap_Case: 0603; Published: 2008-06-19; Publisher: Texas Instruments; LatestRevisionDate: 2016-01-22; ComponentLink1Description: Datasheet link; ComponentLink1URL: http://www.kemet.com/kemet/web/homepage/kechome.nsf/vapubfiles/F3102_Y5V.pdf/$file/F3102_Y5V.pdf; Supplier 1: Digi-Key; Supplier Part Number 1: 399-1099-1-ND; Supplier 2: Mouser; Supplier Part Number 2: 80-C0603C104M4R; Supplier 3: Farnell; Supplier Part Number 3: 1166968; AEC Qualified: ?
J2 = CONN_HDMI_SD-47151-001: as J1 on sheet HDMI8x8_InputConnector; ComponentHeight: 4.5 mm; SymbolVersion: 10/16/2009 11:19:45; ComponentLink1URL: \\vette02\pmp_pcb\pcad_pdf's\471510001_sd.pdf; PackageReference: 12.50 x 15.00 mm; ComponentLink1Description: AEO Datasheet Link
U6 = TPD12S016PWR: Value-Line HDMI Companion Chip for Portable Applications, 12 Channels, -40 to +85 degC, 24-pin TSSOP (PW), Green (RoHS & no Sb/Br); Manufacturer: Texas Instruments; Alternate PartNumber: Equivalent; Breakdown Voltage(Min)(V): 9; Differential Capacitance(pF): 0.05; IEC 61000-4-2 Contact(+/- kV): 8; IO Capacitance(Typ)(pF): 1; IO Leakage Current(nA): 1000; SubFamily: ESD Solution; DatasheetVersion: SLLSE96A; PackageVersion: revG, Feb-2011; PackageReference: PW0024A; PackageDescription: 24-Pin Thin Small Outline Package 0.65 mm Pitch; Supplier 1: Digi-Key; Supplier Part Number 1: 296-29690-2-ND; Supplier 2: Digi-Key; Supplier Part Number 2: 296-29690-1-ND; Supplier 3: Digi-Key; Supplier Part Number 3: 296-29690-6-ND; Supplier 4: Farnell; Supplier Part Number 4: 2076029; Supplier 5: Newark; Supplier Part Number 5: 75T5157; Supplier 6: Newark; Supplier Part Number 6: 71T5431; Supplier 7: Mouser; Supplier Part Number 7: 595-TPD12S016PWR; Eco-Plan: Green (RoHS & no Sb/Br); MountType: SMT; Code_JEDEC: MO-153; PartNumber: TPD12S016PWR; ComponentLink1Description: Datasheet; ComponentLink1URL: http://www.ti.com/general/docs/lit/getliterature.tsp?genericPartNumber=TPD12S016&fileType=pdf; ComponentLink2Description: URL Link1; ComponentLink2URL: SamplesURL:http://www.ti.com/product/tpd12s016#samples; Alternate Manufacturer: Texas Instruments

## Nets that join several sheets
GND: HDMI8x8_InputConnector (18 pins), HDMI8x8_HSSwitchSet (16 pins), HDMI8x8_OutputConnector (11 pins)
V3V3: HDMI8x8_InputConnector (C2.1 U5.2), HDMI8x8_OutputConnector (C5.1 U6.5 U6.12 U6.24)
V5V: HDMI8x8_InputConnector (C3.1 J1.18 U5.1), HDMI8x8_OutputConnector (C6.1 U6.11)
CEC: HDMI8x8_InputConnector (U5.16), HDMI8x8_OutputConnector (U6.1)
CLKIn_N1: HDMI8x8_InputConnector (J1.12 U5.15 U5.24), HDMI8x8_HSSwitchSet (U1.6)
CLKIn_P1: HDMI8x8_InputConnector (J1.10 U5.13 U5.26), HDMI8x8_HSSwitchSet (U1.5)
CLKOutN1: HDMI8x8_HSSwitchSet (U1.59), HDMI8x8_OutputConnector (J2.12 U6.16)
CLKOutP1: HDMI8x8_HSSwitchSet (U1.60), HDMI8x8_OutputConnector (J2.10 U6.15)
D0In_N1: HDMI8x8_InputConnector (J1.9 U5.12 U5.27), HDMI8x8_HSSwitchSet (U2.6)
D0In_P1: HDMI8x8_InputConnector (J1.7 U5.10 U5.29), HDMI8x8_HSSwitchSet (U2.5)
D0OutN1: HDMI8x8_HSSwitchSet (U3.59), HDMI8x8_OutputConnector (J2.9 U6.17)
D0OutP1: HDMI8x8_HSSwitchSet (U3.60), HDMI8x8_OutputConnector (J2.7 U6.18)
D1In_N1: HDMI8x8_InputConnector (J1.6 U5.9 U5.30), HDMI8x8_HSSwitchSet (U3.6)
D1In_P1: HDMI8x8_InputConnector (J1.4 U5.7 U5.32), HDMI8x8_HSSwitchSet (U3.5)
D1OutN1: HDMI8x8_HSSwitchSet (U4.59), HDMI8x8_OutputConnector (J2.6 U6.20)
D1OutP1: HDMI8x8_HSSwitchSet (U4.60), HDMI8x8_OutputConnector (J2.4 U6.21)
D2In_N1: HDMI8x8_InputConnector (J1.3 U5.6 U5.33), HDMI8x8_HSSwitchSet (U4.6)
D2In_P1: HDMI8x8_InputConnector (J1.1 U5.4 U5.35), HDMI8x8_HSSwitchSet (U4.5)
D2OutN1: HDMI8x8_HSSwitchSet (U2.59), HDMI8x8_OutputConnector (J2.3 U6.22)
D2OutP1: HDMI8x8_HSSwitchSet (U2.60), HDMI8x8_OutputConnector (J2.1 U6.23)
DDCSCL: HDMI8x8_InputConnector (U5.17), HDMI8x8_OutputConnector (U6.2)
DDCSDA: HDMI8x8_InputConnector (U5.18), HDMI8x8_OutputConnector (U6.3)
HPD: HDMI8x8_InputConnector (U5.19), HDMI8x8_OutputConnector (U6.4)

## Assembly variants
001: not fitted FID1 FID2 FID3